# EasyEDA Pro project 通用F405飞控_2025-10-30.epro, schematic 电源
Board Name: Board2; Create Date: 2025-10-21; Page Name: P1; Project Name: 通用F405飞控; Schematic Name: 电源; Update Date: 2025-10-23; Company: 嘉立创EDA; Page Size: A4; Version: V1.0
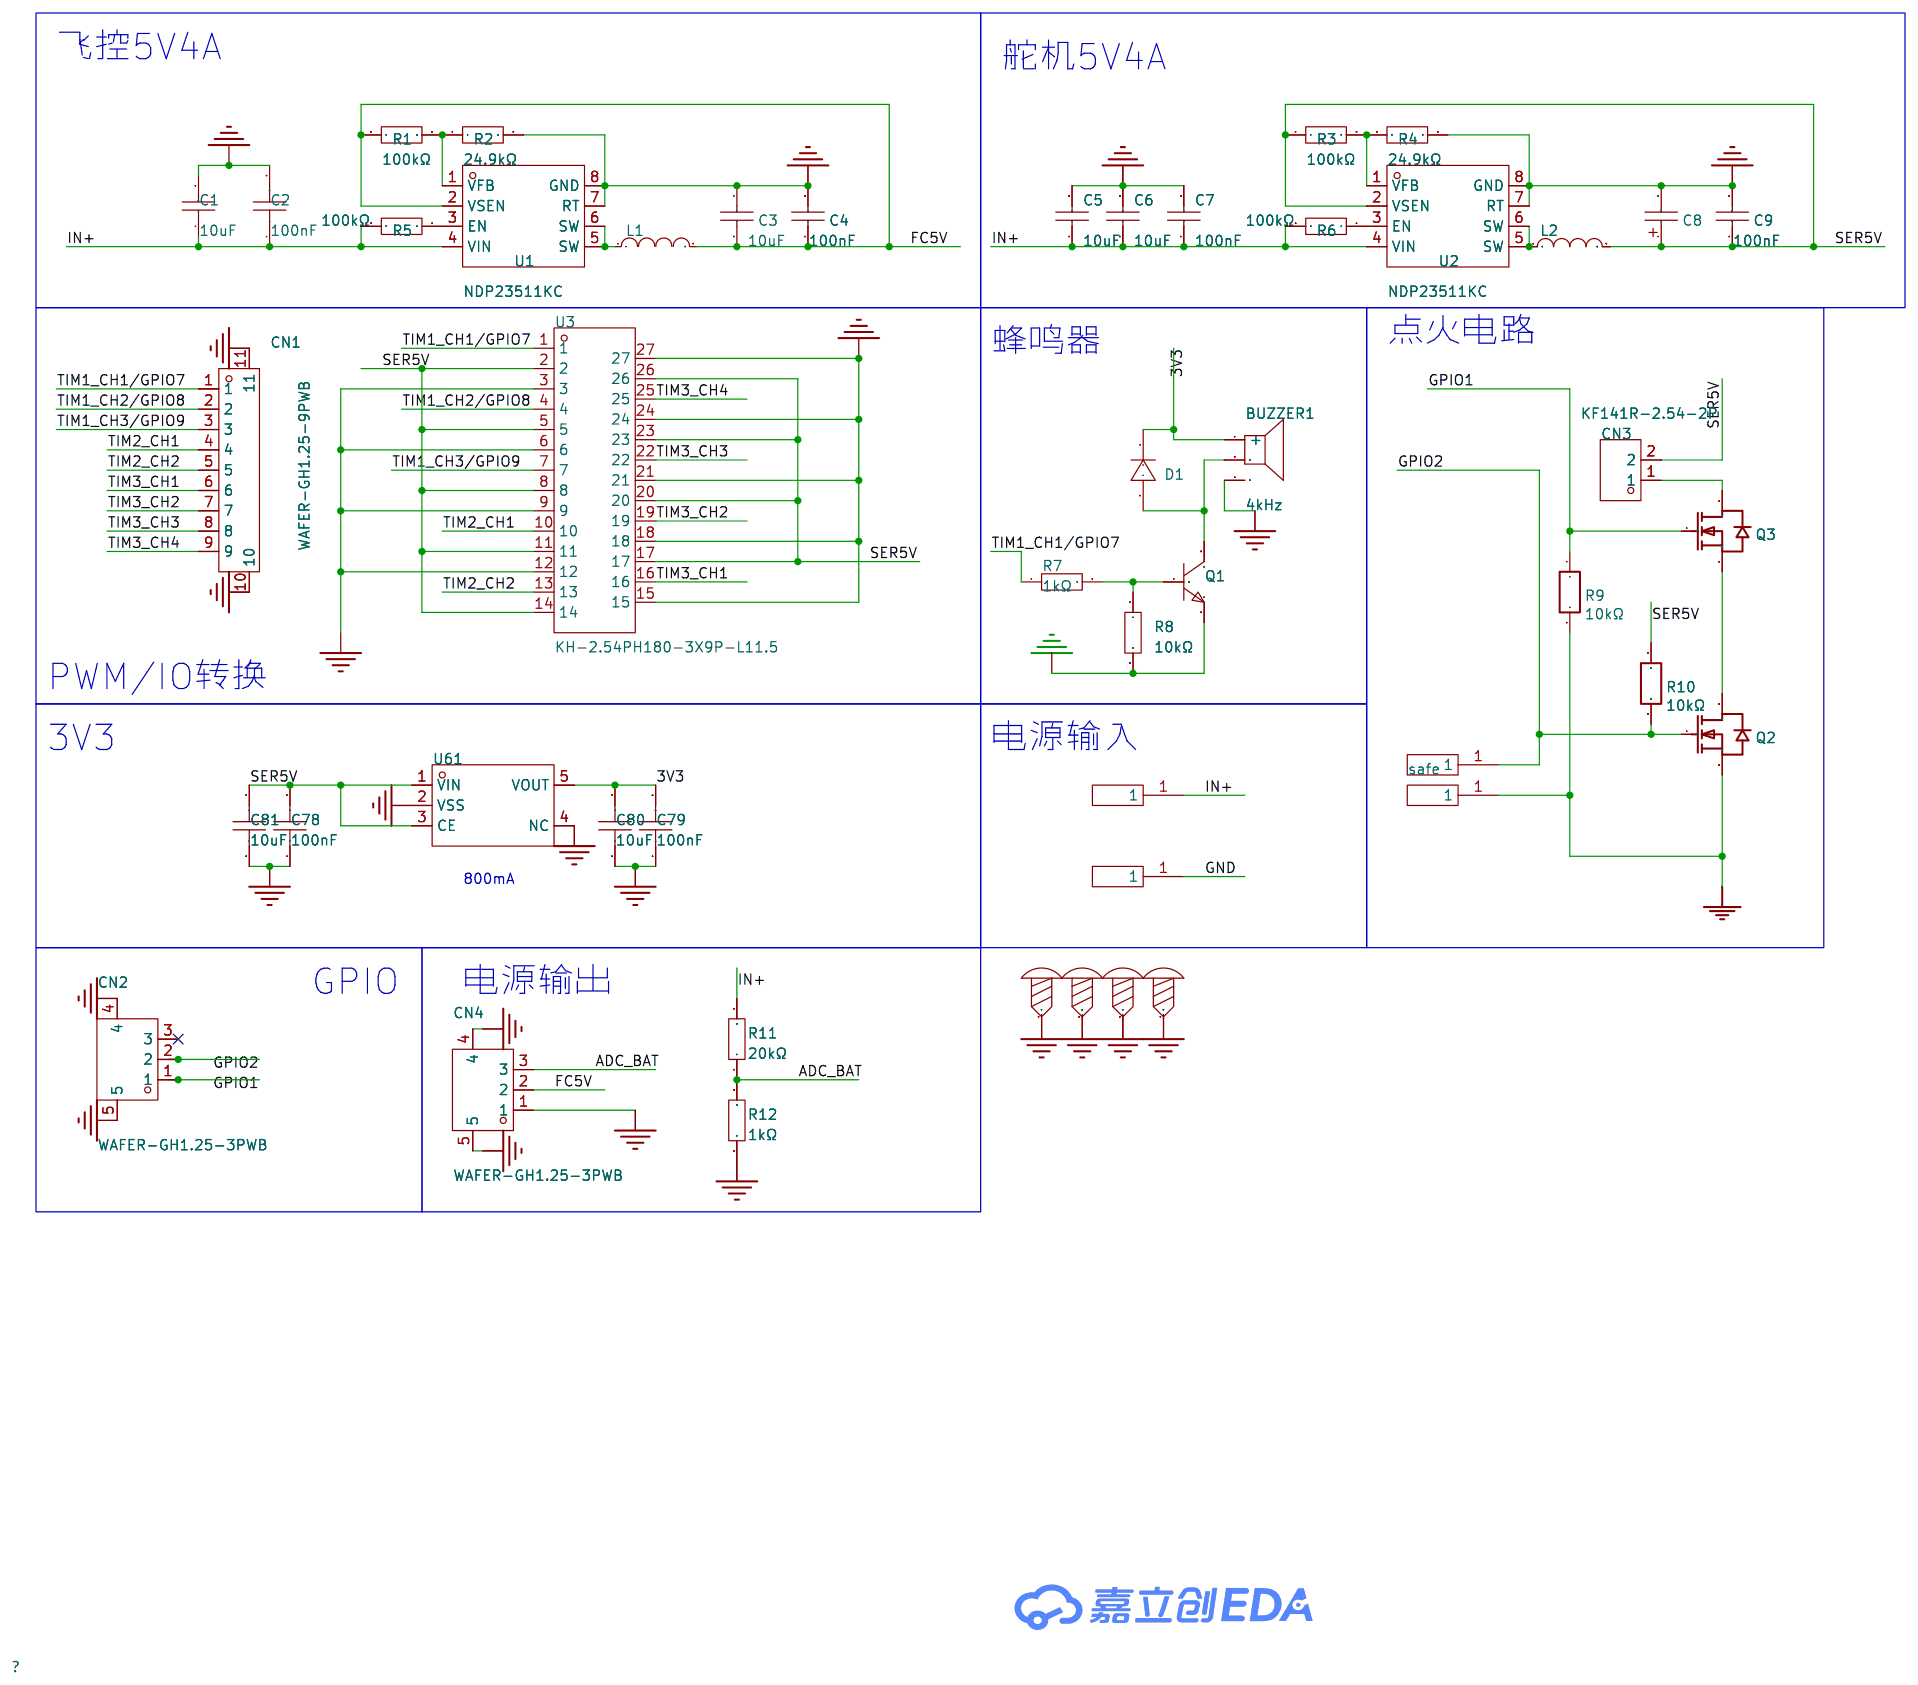
[diagram p0: schematic sheet]

## Parts
BUZZER1  4kHz  [BUZ-SMD_FST-5020]
C1  10uF  [C1206]
C2  100nF  [C0603]
C3  10uF  [C1206]
C4  100nF  [C0603]
C5  10uF  [C1206]
C6  10uF  [C1206]
C7  100nF  [C0603]
C8  330uF  [CASE-D_7343]
C9  100nF  [C0603]
C78  100nF  [C0603]
C79  100nF  [C0603]
C80  10uF  [C0603]
C81  10uF  [C0603]
CN1  WAFER-GH1.25-9PWB  [CONN-SMD_9P-P1.25_XUNPU_WAFER-GH1.25-9PWB]
CN2  WAFER-GH1.25-3PWB  [CONN-TH_3P-P1.25_GH1.25]
CN3  KF141R-2.54-2P  [CONN-TH_2P-P2.54_KF141R-2.54-2P]
CN4  WAFER-GH1.25-3PWB  [CONN-TH_3P-P1.25_GH1.25]
D1  1N4148WS  [SOD-323_L1.8-W1.3-LS2.5-RD]
H1  safe  [焊盘]
H2  -  [焊盘]
H3  -  [电池焊盘]
H4  -  [电池焊盘]
L1  10uH  [IND-SMD_L7.3-W6.8]
L2  10uH  [IND-SMD_L11.6-W10.1]
Q1  SS8050(RANGE:200-350)  [SOT-23-3_L2.9-W1.3-P1.90-LS2.4-BR]
Q2  SI2300  [SOT-23-3_L2.9-W1.4-P1.91-LS2.6-BR]
Q3  SI2300  [SOT-23-3_L2.9-W1.4-P1.91-LS2.6-BR]
R1  100kΩ  [R0603]
R2  24.9kΩ  [R0603]
R3  100kΩ  [R0603]
R4  24.9kΩ  [R0603]
R5  100kΩ  [R0603]
R6  100kΩ  [R0603]
R7  1kΩ  [R0603]
R8  10kΩ  [R0603]
R9  10kΩ  [R0603]
R10  10kΩ  [R0603]
R11  20kΩ  [R0603]
R12  1kΩ  [R0603]
SCREW1  -  [M3螺丝]
SCREW2  -  [M3螺丝]
SCREW3  -  [M3螺丝]
SCREW4  -  [M3螺丝]
U1  NDP23511KC  [SOP-8_L4.9-W3.9-P1.27-LS6.0-BL]
U2  NDP23511KC  [SOP-8_L4.9-W3.9-P1.27-LS6.0-BL]
U3  KH-2.54PH180-3X9P-L11.5  [HDR-TH_27P-P2.54-V-M-R3-C9-S5.08]
U61  ME6217C33M5G  [SOT-23-5_L3.0-W1.7-P0.95-LS2.8-BR]

## Library data of the parts
BUZZER1 = FUET-5020: 驱动方式:无源(外部驱动);构造类型:电磁式;频率:4kHz;声压(SPL):75dB;; LCSC Part Name: 电压 3V 频率 4KHZ; Supplier Part: C391029; Manufacturer: FUET(福声科技); Supplier Footprint: SMD,5x5mm; JLCPCB Part Class: 扩展库; Datasheet: https://item.szlcsc.com/datasheet/FUET-5020/367491.html; Supplier: LCSC; Driver Circuitry: 无源(外部驱动); Technology: 电磁式; Voltage - Supply: 2V~4V; Sound Pressure Level(SPL): 75dB; Length: 5mm; Width: 5mm; Height: 2.2mm
C1 C5 C6 = CL31A106KBHNNNE: 容值:10uF;精度:±10%;额定电压:50V;材质(温度系数):X5R;; LCSC Part Name: 10uF ±10% 50V; Supplier Part: C13585; Manufacturer: SAMSUNG(三星); Supplier Footprint: 1206; JLCPCB Part Class: 基础库; Datasheet: https://atta.szlcsc.com/upload/public/pdf/source/20160218/1457707763339.pdf; Supplier: LCSC; Tolerance: ±10%; Voltage Rated: 50V; Temperature Coefficient: X5R
C2 C4 C7 C9 = CGA0603X7R104K500JT: 容值:100nF;精度:±10%;额定电压:50V;材质(温度系数):X7R;; LCSC Part Name: 100nF ±10% 50V; Supplier Part: C6119867; Manufacturer: HRE(芯声); Supplier Footprint: 0603; JLCPCB Part Class: Extended Part; Supplier: LCSC; Tolerance: ±10%; Voltage Rated: 50V; Temperature Coefficient: X7R
C3 = CL31A106KBHNNNE: 容值:10uF;精度:±10%;额定电压:50V;材质(温度系数):X5R;; LCSC Part Name: 10uF ±10% 50V; Supplier Part: C13585; Manufacturer: SAMSUNG(三星); Supplier Footprint: 1206; JLCPCB Part Class: Basic Part; Datasheet: https://atta.szlcsc.com/upload/public/pdf/source/20160218/1457707763339.pdf; Supplier: LCSC; Tolerance: ±10%; Voltage Rated: 50V; Temperature Coefficient: X5R
C8 = TAJD337K010RNJ: 容值:330uF;精度:±10%;额定电压:10V;等效串联电阻:900mΩ@100kHz;; LCSC Part Name: 330uF ±10% 10V; Supplier Part: C7226; Manufacturer: Kyocera AVX; Supplier Footprint: CASE-D-7343; JLCPCB Part Class: Extended Part; Datasheet: https://atta.szlcsc.com/upload/public/pdf/source/20160107/1457707750344.pdf; Supplier: LCSC; Tolerance: ±10%; Rated Voltage: 10V; Equivalent Series Resistance(ESR): 900mΩ@100kHz; Operating Temperature: -55℃~+125℃; Voltage Rated: 10V; Temperature Coefficient: X5R; Ripple Current: 2.8A@100kHz; Lead Spacing: 2.5mm; φD: 6.3mm; L: 5mm; Lifetime @ Temp: 2000hrs@105℃; FootprintName: C1210; DeviceName: GRM32ER61A107ME20L
C78 C79 = CC0603KRX7R9BB104: 容值:100nF;精度:±10%;额定电压:50V;材质(温度系数):X7R;; LCSC Part Name: 100nF ±10% 50V; Supplier Part: C14663; Manufacturer: YAGEO(国巨); Supplier Footprint: 0603; JLCPCB Part Class: Basic Part; Datasheet: https://atta.szlcsc.com/upload/public/pdf/source/20180910/C282072_33301C7F631E79921B82A8DAC6BCC5B3.pdf; Supplier: LCSC; Tolerance: ±10%; Voltage Rated: 50V; Temperature Coefficient: X7R
C80 = CL10A106KP8NNNC: 容值:10uF;精度:±10%;额定电压:10V;材质(温度系数):X5R;; LCSC Part Name: 10uF ±10% 10V; Supplier Part: C19702; Manufacturer: SAMSUNG(三星); Supplier Footprint: 0603; JLCPCB Part Class: Basic Part; Datasheet: https://atta.szlcsc.com/upload/public/pdf/source/20160218/1457707763339.pdf; Supplier: LCSC; Tolerance: ±10%; Voltage Rated: 10V; Temperature Coefficient: X5R
C81 = CL10A106KP8NNNC: 容值:10uF;精度:±10%;额定电压:10V;温度系数:X5R;; LCSC Part Name: 10uF ±10% 10V; Supplier Part: C19702; Manufacturer: SAMSUNG(三星); Supplier Footprint: 0603; JLCPCB Part Class: Basic Part; Datasheet: https://item.szlcsc.com/datasheet/CL10A106KP8NNNC/20411.html; Supplier: LCSC; Tolerance: ±10%; Voltage Rated: 10V; Temperature Coefficient: X5R; Voltage Rating: 10V
CN1 = WAFER-GH1.25-9PWB: 插针结构:1x9P;间距:1.25mm;安装方式:卧贴;参考系列:GH;总PIN数:9P;排数:1;每排PIN数:9;行距:-;额定电流:1A;触头材质:黄铜;触头镀层:锡;工作温度:-25℃~+85℃;; LCSC Part Name: 1x9P 间距:1.25mm 卧贴 系列:GH; Supplier Part: C3029384; Manufacturer: XUNPU(讯普); Supplier Footprint: SMD,P=1.25mm,卧贴; JLCPCB Part Class: 扩展库; Datasheet: https://item.szlcsc.com/datasheet/WAFER-GH1.25-9PWB/3561396.html; Supplier: LCSC; Pins Structure: 1x9P; Pitch: 1.25mm; Mounting Type: 卧贴; Reference Series: GH; Number of Pins: 9P; Number of Rows: 1; Number of PINs Per Row: 9; Current Rating: 1A; Contact Material: 黄铜; Contact Plating: 锡; Operating Temperature: -25℃~+85℃; Voltage Rating: 125V; Plastic Material: LCP; Supplementary Features: 辅助焊脚; Color: 米色; Z-Height of the Board: 4.35mm; X-Length of Bottom Edge on Board (Spacing Line): 14.5mm; Y-Width of Bottom Edge on Board: 5mm
CN2 CN4 = WAFER-GH1.25-3PWB: 插针结构:1x3P;间距:1.25mm;安装方式:卧贴;参考系列:GH;总PIN数:3P;排数:1;每排PIN数:3;行距:-;额定电流:1A;触头材质:黄铜;触头镀层:锡;工作温度:-25℃~+85℃;; LCSC Part Name: 1x3P 间距:1.25mm 卧贴 系列:GH; Supplier Part: C3029378; Manufacturer: XUNPU(讯普); Supplier Footprint: SMD,P=1.25mm,卧贴; JLCPCB Part Class: Extended Part; Datasheet: https://item.szlcsc.com/datasheet/WAFER-GH1.25-3PWB/3561390.html; Supplier: LCSC; Pins Structure: 1x3P; Pitch: 1.25mm; Mounting Type: 卧贴; Reference Series: GH; Number of Pins: 3P; Number of Rows: 1; Number of PINs Per Row: 3; Current Rating: 1A; Contact Material: 黄铜; Contact Plating: 锡; Operating Temperature: -25℃~+85℃; Voltage Rating: 125V; Plastic Material: LCP; Supplementary Features: 辅助焊脚; Color: 米色; Z-Height of the Board: 4.35mm; X-Length of Bottom Edge on Board (Spacing Line): 7mm; Y-Width of Bottom Edge on Board: 5mm
CN3 = KF141R-2.54-2P: 间距:2.54mm;安装方式:-;总PIN数:2P;每排PIN数:2;额定电流:2A;额定电压:150V;线规 - AWG:20~26;线规 - 平方毫米:1;; LCSC Part Name: 2.54mm 每排P数:2; Supplier Part: C475124; Manufacturer: KEFA(科发); Supplier Footprint: 弯插,P=2.54mm; JLCPCB Part Class: Extended Part; Datasheet: https://item.szlcsc.com/datasheet/KF141R-2.54-2P/481620.html; Supplier: LCSC; Pitch: 2.54mm; Number of Pins: 2P; Number of PINs Per Row: 2; Current Rating: 2A; Voltage Rating (Max): 150V; Wire Gauge - AWG: 20~26; Wire Gauge - mm2: 1
D1 = 1N4148WS_C2128: 二极管配置:独立式;功率:200mW;直流反向耐压(Vr):100V;平均整流电流(Io):150mA;正向压降(Vf):1.25V@150mA;反向恢复时间(trr):4ns;; LCSC Part Name: 电压:100V 电流:150mA T4; Supplier Part: C2128; Manufacturer: CJ(江苏长电/长晶); Supplier Footprint: SOD-323; JLCPCB Part Class: 基础库; Datasheet: https://atta.szlcsc.com/upload/public/pdf/source/20140809/1457707208178.pdf; Supplier: LCSC; Diode Configuration: 独立式; Power Dissipation: 200mW; Reverse Voltage (Vr): 100V; Average Rectified Current (Io): 150mA; Forward Voltage (Vf@If): 1.25V@150mA; Reverse Leakage Current: 1uA@75V; Reverse Recovery Time (trr): 4ns; Operating Temperature: +150℃@(Tj)
H1-H4 = 飞控微型焊盘: 20250513 绘制接收机使用
L1 = FXL0630-100-M: 电感值:10uH;精度:±20%;额定电流:4.5A;饱和电流(Isat):5.5A;类型:一体成型电感;; LCSC Part Name: 10uH ±20% 5.5A; Supplier Part: C167223; Manufacturer: cjiang(长江微电); Supplier Footprint: SMD,6.6x7mm; JLCPCB Part Class: Extended Part; Datasheet: https://atta.szlcsc.com/upload/public/pdf/source/20240426/3189EA8206330E2108542F9E34E540E7.pdf; Supplier: LCSC; Tolerance: ±20%; Rated Current: 4.5A; Saturation Current (Isat): 5.5A; DC Resistance (DCR): 68mΩ; Type: 一体成型电感
L2 = CYA1050-10UH: 电感值:10uH;精度:±20%;额定电流:7A;饱和电流(Isat):10A;; LCSC Part Name: 10uH ±20% 10A; Supplier Part: C7529415; Manufacturer: SHOU HAN(首韩); Supplier Footprint: SMD,11.6x10.1mm; JLCPCB Part Class: Extended Part; Datasheet: https://atta.szlcsc.com/upload/public/pdf/source/20230818/55B4CA91C0F0CF0FF5A123A0A2F42BE4.pdf; Supplier: LCSC; Tolerance: ±20%; Rated Current: 7A; Saturation Current (Isat): 10A; DC Resistance (DCR): 28mΩ
Q1 = SS8050_C2150: 晶体管类型:NPN;集电极电流(Ic):1.5A;集射极击穿电压(Vceo):25V;耗散功率(Pd):300mW;直流电流增益(hFE):200@800mA,1V;; LCSC Part Name: hfe=200~350 NPN 电流:1.5A 电压:25V; Supplier Part: C2150; Manufacturer: CJ(江苏长电/长晶); Supplier Footprint: SOT-23; JLCPCB Part Class: Basic Part; Datasheet: https://item.szlcsc.com/datasheet/SS8050(RANGE%253A200-350)/2507.html; Supplier: LCSC; Transistor Type: NPN; Collector-Emitter Breakdown Voltage (Vceo): 25V; Collector Current (Ic): 1.5A; Power Dissipation (Pd): 300mW; Collector Cut-Off Current (Icbo): 100nA; Collector-Emitter Saturation Voltage (VCE(sat)@Ic,Ib): 500mV@800mA,80mA; DC Current Gain (hFE@Ic,Vce): 200@100mA,1V; Transition Frequency (fT): 100MHz; Operating Temperature: -55℃~+150℃; type: NPN; Current - Collector(Ic): 1.5A; Collector - Emitter Voltage VCEO: 25V; Pd - Power Dissipation: 300mW; DC Current Gain: 200@800mA,1V; Transition frequency(fT): 100MHz; Current - Collector Cutoff: 100nA; Vce Saturation(VCE(sat)): 500mV@800mA,80mA; Emitter-Base Voltage(Vebo): 5V; Number: 1个NPN
Q2 Q3 = SI2300_C727150: 数量:1个N沟道;漏源电压(Vdss):20V;连续漏极电流(Id):3.8A;导通电阻(RDS(on)):32mΩ@4.5V；62mΩ@1.8V；50mΩ@2.5V;耗散功率(Pd):1.25W;阈值电压(Vgs(th)):780mV@250uA;; LCSC Part Name: 1个N沟道 耐压:20V 电流:3.8A; Supplier Part: C727150; Manufacturer: TWGMC(迪嘉); Supplier Footprint: SOT-23; JLCPCB Part Class: Extended Part; Datasheet: https://item.szlcsc.com/datasheet/SI2300/774255.html; Supplier: LCSC; Number: 1个N沟道; Drain to Source Voltage: 20V; Current - Continuous Drain(Id): 3.8A; RDS(on): 32mΩ@4.5V；62mΩ@1.8V；50mΩ@2.5V; Pd - Power Dissipation: 1.25W; Gate Threshold Voltage (Vgs(th)): 780mV@250uA; Gate Charge(Qg): 16.8nC@4.5V; Input Capacitance(Ciss): 888pF; Reverse Transfer Capacitance (Crss@Vds): 115pF; Operating Temperature: -55℃~+150℃; Type: N沟道; Output Capacitance(Coss): 144pF
R1 R3 R5 R6 = RC0603FR-07100KL: 电阻类型:厚膜电阻;阻值:100kΩ;精度:±1%;功率:100mW;最大工作电压:75V;温度系数:±100ppm/℃;; LCSC Part Name: 厚膜电阻 100kΩ ±1% 100mW; Supplier Part: C14675; Manufacturer: YAGEO(国巨); Supplier Footprint: 0603; JLCPCB Part Class: 扩展库; Datasheet: https://atta.szlcsc.com/upload/public/pdf/source/20140324/1457707028752.pdf; Supplier: LCSC; Type: 厚膜电阻; Tolerance: ±1%; Power(Watts): 100mW; Overload Voltage (Max): 75V; Temperature Coefficient: ±100ppm/℃; Operating Temperature Range: -55℃~+155℃
R2 = 0603WAF2492T5E: 电阻类型:厚膜电阻;阻值:24.9kΩ;精度:±1%;功率:100mW;最大工作电压:75V;温度系数:±100ppm/℃;; LCSC Part Name: 24.9kΩ ±1% 100mW 厚膜电阻; Supplier Part: C25962; Manufacturer: UNI-ROYAL(厚声); Supplier Footprint: 0603; JLCPCB Part Class: Extended Part; Datasheet: https://atta.szlcsc.com/upload/public/pdf/source/20200306/C422600_1E6D84923E4A46A82E41ADD87F860B5C.pdf; Supplier: LCSC; Type: 厚膜电阻; Tolerance: ±1%; Power(Watts): 100mW; Overload Voltage (Max): 75V; Temperature Coefficient: ±100ppm/℃; Operating Temperature Range: -55℃~+155℃
R4 = 0603WAF2492T5E: 电阻类型:厚膜电阻;阻值:24.9kΩ;精度:±1%;功率:100mW;最大工作电压:75V;温度系数:±100ppm/℃;; LCSC Part Name: 24.9kΩ ±1% 100mW 厚膜电阻; Supplier Part: C25962; Manufacturer: UNI-ROYAL(厚声); Supplier Footprint: 0603; JLCPCB Part Class: 扩展库; Datasheet: https://atta.szlcsc.com/upload/public/pdf/source/20200306/C422600_1E6D84923E4A46A82E41ADD87F860B5C.pdf; Supplier: LCSC; Type: 厚膜电阻; Tolerance: ±1%; Power(Watts): 100mW; Overload Voltage (Max): 75V; Temperature Coefficient: ±100ppm/℃; Operating Temperature Range: -55℃~+155℃
R7 R12 = 0603WAF1001T5E: 电阻类型:厚膜电阻;阻值:1kΩ;精度:±1%;功率:100mW;最大工作电压:75V;温度系数:±100ppm/℃;; LCSC Part Name: 1kΩ ±1% 100mW 厚膜电阻; Supplier Part: C21190; Manufacturer: UNI-ROYAL(厚声); Supplier Footprint: 0603; JLCPCB Part Class: Basic Part; Datasheet: https://atta.szlcsc.com/upload/public/pdf/source/20200306/C422600_1E6D84923E4A46A82E41ADD87F860B5C.pdf; Supplier: LCSC; Type: 厚膜电阻; Tolerance: ±1%; Power(Watts): 100mW; Overload Voltage (Max): 75V; Temperature Coefficient: ±100ppm/℃; Operating Temperature Range: -55℃~+155℃
R8 = 0603WAF1002T5E: 电阻类型:厚膜电阻;阻值:10kΩ;精度:±1%;功率:100mW;最大工作电压:75V;温度系数:±100ppm/℃;; LCSC Part Name: 厚膜电阻 10kΩ ±1% 100mW; Supplier Part: C25804; Manufacturer: UNI-ROYAL(厚声); Supplier Footprint: 0603; JLCPCB Part Class: Basic Part; Datasheet: https://atta.szlcsc.com/upload/public/pdf/source/20200306/C422600_1E6D84923E4A46A82E41ADD87F860B5C.pdf; Supplier: LCSC; Type: 厚膜电阻; Tolerance: ±1%; Power(Watts): 100mW; Overload Voltage (Max): 75V; Temperature Coefficient: ±100ppm/℃; Operating Temperature Range: -55℃~+155℃
R9 R10 = 0603WAF1002T5E: 电阻类型:厚膜电阻;阻值:10kΩ;精度:±1%;功率:100mW;工作电压:75V;温度系数:±100ppm/℃;; LCSC Part Name: 厚膜电阻 10kΩ ±1% 100mW; Supplier Part: C25804; Manufacturer: UNI-ROYAL(厚声); Supplier Footprint: 0603; JLCPCB Part Class: Basic Part; Datasheet: https://atta.szlcsc.com/upload/public/pdf/source/20200306/C422600_1E6D84923E4A46A82E41ADD87F860B5C.pdf; Supplier: LCSC; Type: 厚膜电阻; Tolerance: ±1%; Power(Watts): 100mW; Overload Voltage (Max): 75V; Temperature Coefficient: ±100ppm/℃; Operating Temperature Range: -55℃~+155℃; Voltage-Supply(Max): 75V; Operating Temperature: -55℃~+155℃
R11 = 0603WAF2002T5E: 电阻类型:厚膜电阻;阻值:20kΩ;精度:±1%;功率:100mW;最大工作电压:75V;温度系数:±100ppm/℃;; LCSC Part Name: 20kΩ ±1% 100mW 厚膜电阻; Supplier Part: C4184; Manufacturer: UNI-ROYAL(厚声); Supplier Footprint: 0603; JLCPCB Part Class: Basic Part; Datasheet: https://atta.szlcsc.com/upload/public/pdf/source/20200306/C422600_1E6D84923E4A46A82E41ADD87F860B5C.pdf; Supplier: LCSC; Type: 厚膜电阻; Tolerance: ±1%; Power(Watts): 100mW; Overload Voltage (Max): 75V; Temperature Coefficient: ±100ppm/℃; Operating Temperature Range: -55℃~+155℃
SCREW1-SCREW4 = M3螺丝: Supplier Footprint: 插件
U1 U2 = NDP23511KC: 功能类型:降压型;; Supplier Part: C17702285; Manufacturer: NDP(芯潭微); Supplier Footprint: SOP-8; JLCPCB Part Class: Extended Part; Supplier: LCSC; Function: 降压型; Switch tube (built-in/external): 内置
U3 = KH-2.54PH180-3X9P-L11.5: 插针结构:3x9P;间距:2.54mm;行距:2.54mm;圆针/方针:方针;安装方式:直插;排数:三排;总PIN位数:27P;额定电流:3A;配合针长度:6mm;塑高:2.5mm;端接针长度:3mm;触头材质:铜合金;触头镀层:金;工作温度:-40℃~+105℃;颜色:黑色;; LCSC Part Name: 3x9P 间距:2.54mm 方针 直插; Supplier Part: C20610256; Manufacturer: kinghelm(金航标); Supplier Footprint: 插件,P=2.54mm; JLCPCB Part Class: 扩展库; Datasheet: https://item.szlcsc.com/datasheet/KH-2.54PH180-3X9P-L11.5/21960901.html; Supplier: LCSC; Pin Structure: 3x9P; Pitch: 2.54mm; Row Spacing: 2.54mm; Circluar Pins/Square Pins: 方针; Mounting Type: 直插; Number of Rows: 三排; Number of Pins: 27P; Current Rating: 3A; Length of Mating Pin: 6mm; Insulation Height: 2.5mm; Length of End Connection Pin: 3mm; Contact Material: 铜合金; Contact Plating: 金; Operating Temperature: -40℃~+105℃; Color: 黑色
U61 = ME6217C33M5G: 输出类型:固定;输出极性:正;最大输入电压:7V;输出电压:3.3V;输出电流:800mA;电源纹波抑制比(PSRR):65dB@(1kHz);; Supplier Part: C427602; Manufacturer: MICRONE(南京微盟); Supplier Footprint: SOT-23-5; JLCPCB Part Class: 扩展库; Datasheet: https://atta.szlcsc.com/upload/public/pdf/source/20190910/C427602_D4B9162A2E9D9EF57C60010DFDECEF37.pdf; Supplier: LCSC; Output Type: 固定; Output Polarity: 正; Number of Outputs: 1; Maximum Input Voltage: 7V; Output Voltage: 3.3V; Dropout Voltage: 180mV@(300mA); Output Current: 800mA; Power Supply Rejection Ratio (PSRR): 65dB@(1kHz)

## Nets
3V3: BUZZER1.1(+) C79.2 C80.2 D1.1(K) U61.5(VOUT)
GND: BUZZER1.3 C1.2 C2.2 C3.1 C4.2 C5.2 C6.2 C7.2 C8.2 C9.2 C78.1 C79.1 C80.1 C81.1 CN1.10 CN1.11 CN2.4 CN2.5 CN4.1 CN4.4 CN4.5 H2.1 H4.1 Q1.2(E) Q2.2(S) R2.2 R4.2 R8.2 R9.2 R12.1 SCREW1.1 SCREW2.1 SCREW3.1 SCREW4.1 U1.7(RT) U1.8(GND) U2.7(RT) U2.8(GND) U3.3 U3.6 U3.9 U3.12 U3.15 U3.18 U3.21 U3.24 U3.27 U61.2(VSS) U61.4(NC)
ADC_BAT: CN4.3 R11.1 R12.2
FC5V: C3.2 C4.1 CN4.2 L1.2 R1.1 U1.2(VSEN)
GPIO1: CN2.1 Q3.1(G) R9.1
GPIO2: CN2.2 H1.1 Q2.1(G) R10.2
IN+: C1.1 C2.1 C5.1 C6.1 C7.1 H3.1 R5.2 R6.2 R11.2 U1.4(VIN) U2.4(VIN)
SER5V: C8.1 C9.1 C78.2 C81.2 CN3.2 L2.2 R3.1 R10.1 U2.2(VSEN) U3.2 U3.5 U3.8 U3.11 U3.14 U3.17 U3.20 U3.23 U3.26 U61.1(VIN) U61.3(CE)
TIM1_CH1/GPIO7: CN1.1 R7.1 U3.1
TIM1_CH2/GPIO8: CN1.2 U3.4
TIM1_CH3/GPIO9: CN1.3 U3.7
TIM2_CH1: CN1.4 U3.10
TIM2_CH2: CN1.5 U3.13
TIM3_CH1: CN1.6 U3.16
TIM3_CH2: CN1.7 U3.19
TIM3_CH3: CN1.8 U3.22
TIM3_CH4: CN1.9 U3.25
$1N427: R1.2 R2.1 U1.1(VFB)
$1N431: L1.1 U1.5(SW) U1.6(SW)
$1N432: R5.1 U1.3(EN)
$1N848: R3.2 R4.1 U2.1(VFB)
$1N849: L2.1 U2.5(SW) U2.6(SW)
$1N850: R6.1 U2.3(EN)
$1N2141: BUZZER1.2 D1.2(A) Q1.3(C)
$1N2142: Q1.1(B) R7.2 R8.1
$1N2890: CN3.1 Q3.3(D)
$1N2891: Q2.3(D) Q3.2(S)

Not connected (* = marked no-connect by the designer): CN2 3*

## Notes on the sheet
- 飞控5V4A
- 舵机5V4A
- 蜂鸣器
- 点火电路
- PWM/IO转换
- 3V3
- 电源输入
- 800mA
- GPIO
- 电源输出
